# Altium schematic sheet ESP32_Microcontroller.SchDoc
size A4; SheetNumber: 2; SheetTotal: 5
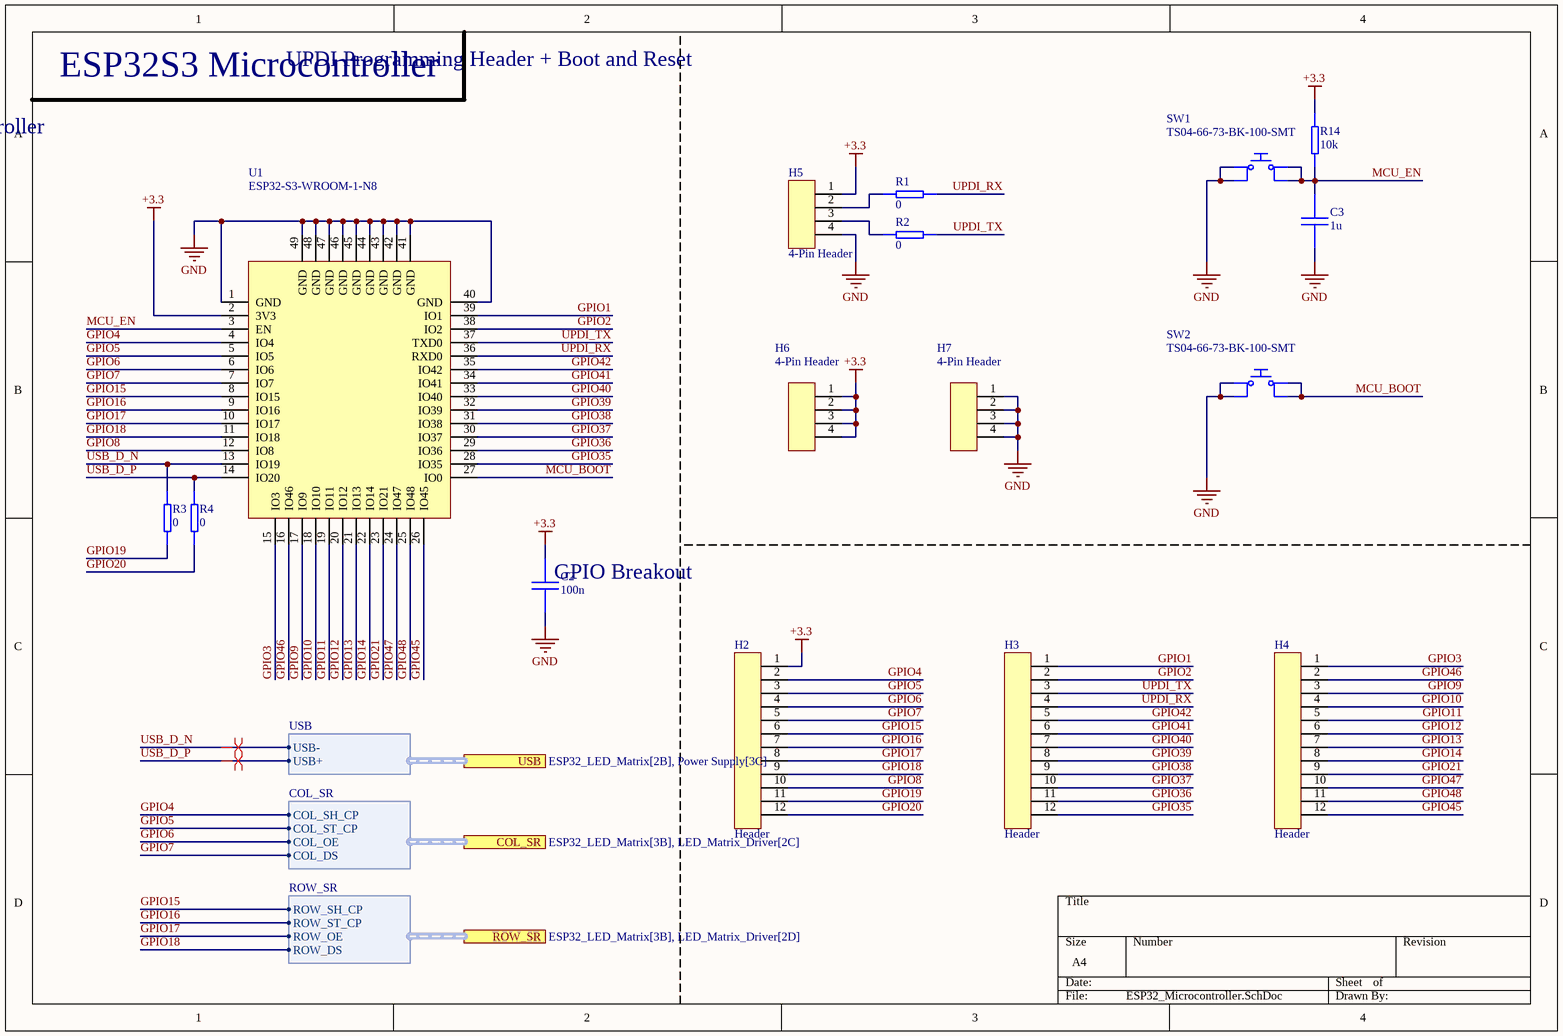
[diagram p0: ESP32_Microcontroller.SchDoc]

## Parts
C2  100n  [CAP0805]
C3  1u  [CAP0805]
H2  Header  [Header_1X12]
H3  Header  [Header_1X12]
H4  Header  [Header_1X12]
H5  4-Pin Header  [Header_1X4]
H6  4-Pin Header  [Header_1X4]
H7  4-Pin Header  [Header_1X4]
R1  0  [RESC0805]
R2  0  [RESC0805]
R3  0  [RESC0805]
R4  0  [RESC0805]
R14  10k  [RESC0805]
SW1  TS04-66-73-BK-100-SMT  [Tactile Button 6.0mm x 6.0mm]
SW2  TS04-66-73-BK-100-SMT  [Tactile Button 6.0mm x 6.0mm]
U1  ESP32-S3-WROOM-1-N8  [ESP32-S3-WROOM-1-N8]

## Ports
COL_SR (harness COL_SR, see ESP32_LED_Matrix[3B], LED_Matrix_Driver[2C]), ROW_SR (harness ROW_SR, see ESP32_LED_Matrix[3B], LED_Matrix_Driver[2D]), USB (harness USB, see ESP32_LED_Matrix[2B], Power Supply[3C])

## Harnesses
COL_SR: COL_SH_CP, COL_ST_CP, COL_OE, COL_DS
ROW_SR: ROW_SH_CP, ROW_ST_CP, ROW_OE, ROW_DS
USB: USB-, USB+

## Nets
+3.3: C2.1 H2.1 H5.1 H6.1 H6.2 H6.3 H6.4 R14.1 U1.2(3V3)
GND: C2.2 C3.2 H5.4 H7.1 H7.2 H7.3 H7.4 SW1.1 SW1.2 SW2.1 SW2.2 U1.1(GND) U1.40(GND) U1.41(GND) U1.42(GND) U1.43(GND) U1.44(GND) U1.45(GND) U1.46(GND) U1.47(GND) U1.48(GND) U1.49(GND)
GPIO1: H3.1 U1.39(IO1)
GPIO2: H3.2 U1.38(IO2)
GPIO3: H4.1 U1.15(IO3)
GPIO4: H2.2 U1.4(IO4) ; port COL_SR.COL_SH_CP
GPIO5: H2.3 U1.5(IO5) ; port COL_SR.COL_ST_CP
GPIO6: H2.4 U1.6(IO6) ; port COL_SR.COL_OE
GPIO7: H2.5 U1.7(IO7) ; port COL_SR.COL_DS
GPIO8: H2.10 U1.12(IO8)
GPIO9: H4.3 U1.17(IO9)
GPIO10: H4.4 U1.18(IO10)
GPIO11: H4.5 U1.19(IO11)
GPIO12: H4.6 U1.20(IO12)
GPIO13: H4.7 U1.21(IO13)
GPIO14: H4.8 U1.22(IO14)
GPIO15: H2.6 U1.8(IO15) ; port ROW_SR.ROW_SH_CP
GPIO16: H2.7 U1.9(IO16) ; port ROW_SR.ROW_ST_CP
GPIO17: H2.8 U1.10(IO17) ; port ROW_SR.ROW_OE
GPIO18: H2.9 U1.11(IO18) ; port ROW_SR.ROW_DS
GPIO19: H2.11 R3.1
GPIO20: H2.12 R4.1
GPIO21: H4.9 U1.23(IO21)
GPIO35: H3.12 U1.28(IO35)
GPIO36: H3.11 U1.29(IO36)
GPIO37: H3.10 U1.30(IO37)
GPIO38: H3.9 U1.31(IO38)
GPIO39: H3.8 U1.32(IO39)
GPIO40: H3.7 U1.33(IO40)
GPIO41: H3.6 U1.34(IO41)
GPIO42: H3.5 U1.35(IO42)
GPIO45: H4.12 U1.26(IO45)
GPIO46: H4.2 U1.16(IO46)
GPIO47: H4.10 U1.24(IO47)
GPIO48: H4.11 U1.25(IO48)
MCU_BOOT: SW2.3 SW2.4 U1.27(IO0)
MCU_EN: C3.1 R14.2 SW1.3 SW1.4 U1.3(EN)
UPDI_RX: H3.4 R1.1 U1.36(RXD0)
UPDI_TX: H3.3 R2.1 U1.37(TXD0)
USB_D_N: R3.2 U1.13(IO19) ; port USB.USB-
USB_D_P: R4.2 U1.14(IO20) ; port USB.USB+
NetH5_2: H5.2 R1.2
NetH5_3: H5.3 R2.2

## Layout directives
differential pair: USB_D_N, USB_D_P

## Notes on the sheet
- ESP32S3 Microcontroller
- UPDI Programming Header + Boot and Reset
- Microcontroller
- GPIO Breakout

## Library data of the parts
C2 C3 = Capacitor - Non Polarized: Non Polarized Capacitor
H2-H4 = 12-Pin Header
R1-R4 R14 = Resistor
SW1 SW2 = TS04-66-73-BK-100-SMT: Switch; Manufacturer_Name: Same Sky; Datasheet Link: https://www.sameskydevices.com/product/resource/supplyframepdf/ts04.pdf; Height: 7.6mm; Manufacturer_Part_Number: TS04-66-73-BK-100-SMT; Mouser Part Number: 179-TS046673BK100SMT; Mouser Price/Stock: https://www.mouser.co.uk/ProductDetail/Same-Sky/TS04-66-73-BK-100-SMT?qs=A6eO%252BMLsxmRAmp3wqRUzZw%3D%3D; Arrow Part Number: TS04-66-73-BK-100-SMT; Arrow Price/Stock: https://www.arrow.com/en/products/ts04-66-73-bk-100-smt/cui-devices?utm_currency=USD&region=nac
U1 = ESP32-S3-WROOM-1-N8: ESP32 Microcontroller with Bluetooth and Wifi